# Altium schematic sheet 1.SchDoc
size A4; SheetNumber: 1; SheetTotal: 5
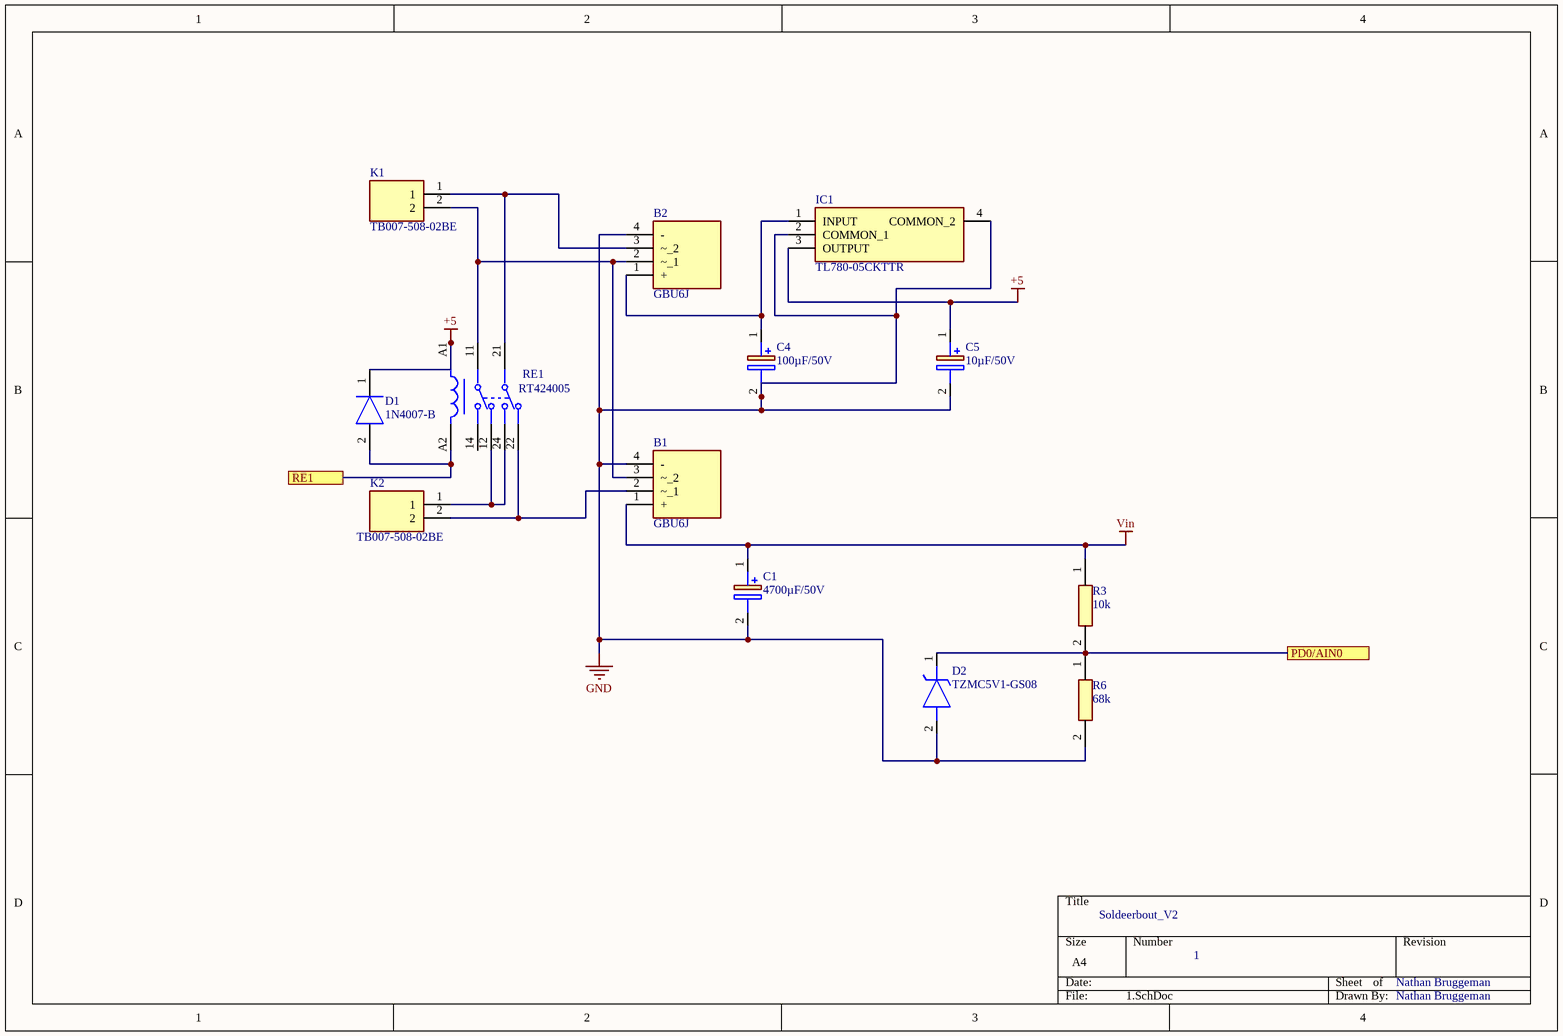
[diagram p0: 1.SchDoc]

## Parts
B1  GBU6J  [GBU6J]
B2  GBU6J  [GBU6J]
C1  4700µF/50V  [CAPPRD1000W80D2200H3700]
C4  100µF/50V  [CAPPRD350W60D800H1250]
C5  10µF/50V  [CAPPRD200W55D500H1200]
D1  1N4007-B  [DIOAD1410W90L470D235]
D2  TZMC5V1-GS08  [TZMC5V1GS08]
IC1  TL780-05CKTTR  [TL78005CKTTR]
K1  TB007-508-02BE  [TB00750802BE]
K2  TB007-508-02BE  [TB00750802BE]
R3  10k  [0805]
R6  68k  [0805]
RE1  RT424005  [FP-RT424005-MFG]

## Ports
PD0/AIN0, RE1

## Nets
+5: C5.1(+) D1.1(K) IC1.3(OUTPUT) RE1.A1
GND: B1.4(-) B2.4(-) C1.2(-) C4.2(-) C5.2(-) D2.2(A) IC1.2(COMMON_1) IC1.4(COMMON_2) R6.2
Vin: B1.1(+) C1.1(+) R3.1
PD0/AIN0: D2.1(K) R3.2 R6.1 ; port PD0/AIN0
RE1: D1.2(A) RE1.A2 ; port RE1
NetB1_2: B1.2(~_1) K2.2 RE1.22
NetB1_3: B1.3(~_2) B2.2(~_1) K1.2 RE1.11
NetB2_1: B2.1(+) C4.1(+) IC1.1(INPUT)
NetB2_3: B2.3(~_2) K1.1 RE1.21
NetK2_1: K2.1 RE1.12 RE1.24

Not connected (* = marked no-connect by the designer): RE1 14

## Notes on the sheet
- Soldeerbout_V2
- 1
- Nathan Bruggeman

## Library data of the parts
B1 B2 = GBU6J: Bridge Rectifier; Manufacturer_Name: GeneSiC Semiconductor; Datasheet Link: https://www.diodemodule.com/silicon_products/bridge_rectifiers/gbu6j.pdf; Height: 18.8mm; Manufacturer_Part_Number: GBU6J
C1 = ESK478M050AQ3AA: Capacitor Polarised; Manufacturer_Name: Kemet; Datasheet Link: https://componentsearchengine.com//ESK478M050AQ3AA.pdf; Height: 37mm; Mouser2 Part Number: 80-ESK478M050AQ3AA; Mouser2 Price/Stock: https://www.mouser.com/Search/Refine.aspx?Keyword=80-ESK478M050AQ3AA; Manufacturer_Part_Number: ESK478M050AQ3AA
C4 = ESK107M050AG3EA: Capacitor Polarised; Manufacturer_Name: Kemet; Height: 12.5mm; Manufacturer_Part_Number: ESK107M050AG3EA
C5 = ECA-1HM100: Capacitor Polarised; Manufacturer_Name: Panasonic; Datasheet Link: https://componentsearchengine.com//ECA-1HM100.pdf; Height: 12mm; Mouser2 Part Number: 667-ECA-1HM100; Mouser2 Price/Stock: https://www.mouser.com/Search/Refine.aspx?Keyword=667-ECA-1HM100; Manufacturer_Part_Number: ECA-1HM100
D1 = 1N4007-B: Diode; Manufacturer_Name: Rectron; Datasheet Link: https://www.arrow.com/en/products/1n4007-b/rectron; Manufacturer_Part_Number: 1N4007-B
D2 = TZMC5V1-GS08: Zener Diode; Manufacturer_Name: Vishay; Datasheet Link: https://componentsearchengine.com/Datasheets/2/TZMC5V1-GS08.pdf; Height: 1.6mm; Manufacturer_Part_Number: TZMC5V1-GS08
IC1 = TL780-05CKTTR: Integrated Circuit; Manufacturer_Name: Texas Instruments; Datasheet Link: http://www.ti.com/general/docs/suppproductinfo.tsp?distId=26&gotoUrl=http%3A%2F%2Fwww.ti.com%2Flit%2Fgpn%2Ftl780; Height: 5.08mm; Manufacturer_Part_Number: TL780-05CKTTR
K1 K2 = TB007-508-02BE: Connector; Manufacturer_Name: CUI Inc.; Datasheet Link: https://componentsearchengine.com//TB007-508-02BE.pdf; Height: 14mm; Mouser2 Part Number: 490-TB007-508-02BE; Mouser2 Price/Stock: https://www.mouser.com/Search/Refine.aspx?Keyword=490-TB007-508-02BE; Manufacturer_Part_Number: TB007-508-02BE
R3 R6 = CFN0805-FZ-R030ELF: Resistor; Manufacturer_Name: Bourns; Datasheet Link: https://www.bourns.com/docs/Product-Datasheets/CFN.pdf; Height: 0.9mm; Manufacturer_Part_Number: CFN0805-FZ-R030ELF
RE1 = CMP-03395-000087-1: RELAY GENERAL PURPOSE DPDT 8A 5V; Manufacturer: TE Connectivity; Coil Power: 403mW; Number Of Contacts: 2; Coil Resistance: 62Ω; Coil Type: Non-Latching; Manufacturer Part Number: RT424005; Category: Relay; Octopart: https://octopart.com/5-1393243-9-te+connectivity-41835766; Device Class L3: Power Relays; ComponentLink2URL: https://www.te.com/commerce/DocumentDelivery/DDEController?Action=showdoc&DocId=Data+Sheet%7FRT2%7F1014%7Fpdf%7FEnglish%7FENG_DS_RT2_1014.pdf%7F5-1393243-9; Ambient Temperature Range High: +85°C; ComponentLink2Description: Datasheet; Throw Configuration: DPDT; Digikey Description: RELAY GENERAL PURPOSE DPDT 8A 5V; Package: RT424005; Automotive: No; Device Class L1: Electromechanical; Height: 15.7mm; Device Class L2: Relays; Ambient Temperature Range Low: -40°C; Coil Voltage: 5V; Current Rating: 8A; Mouser Description: General Purpose Relay, Rt2 Series, Power, Non Latching, Dpdt, 5 Vdc, 8 A Rohs Compliant: Yes; Lead Free: Yes; RoHS: TRUE